# EAGLE design Electret_Microphone_Breakout (EAGLE 7.5.0)
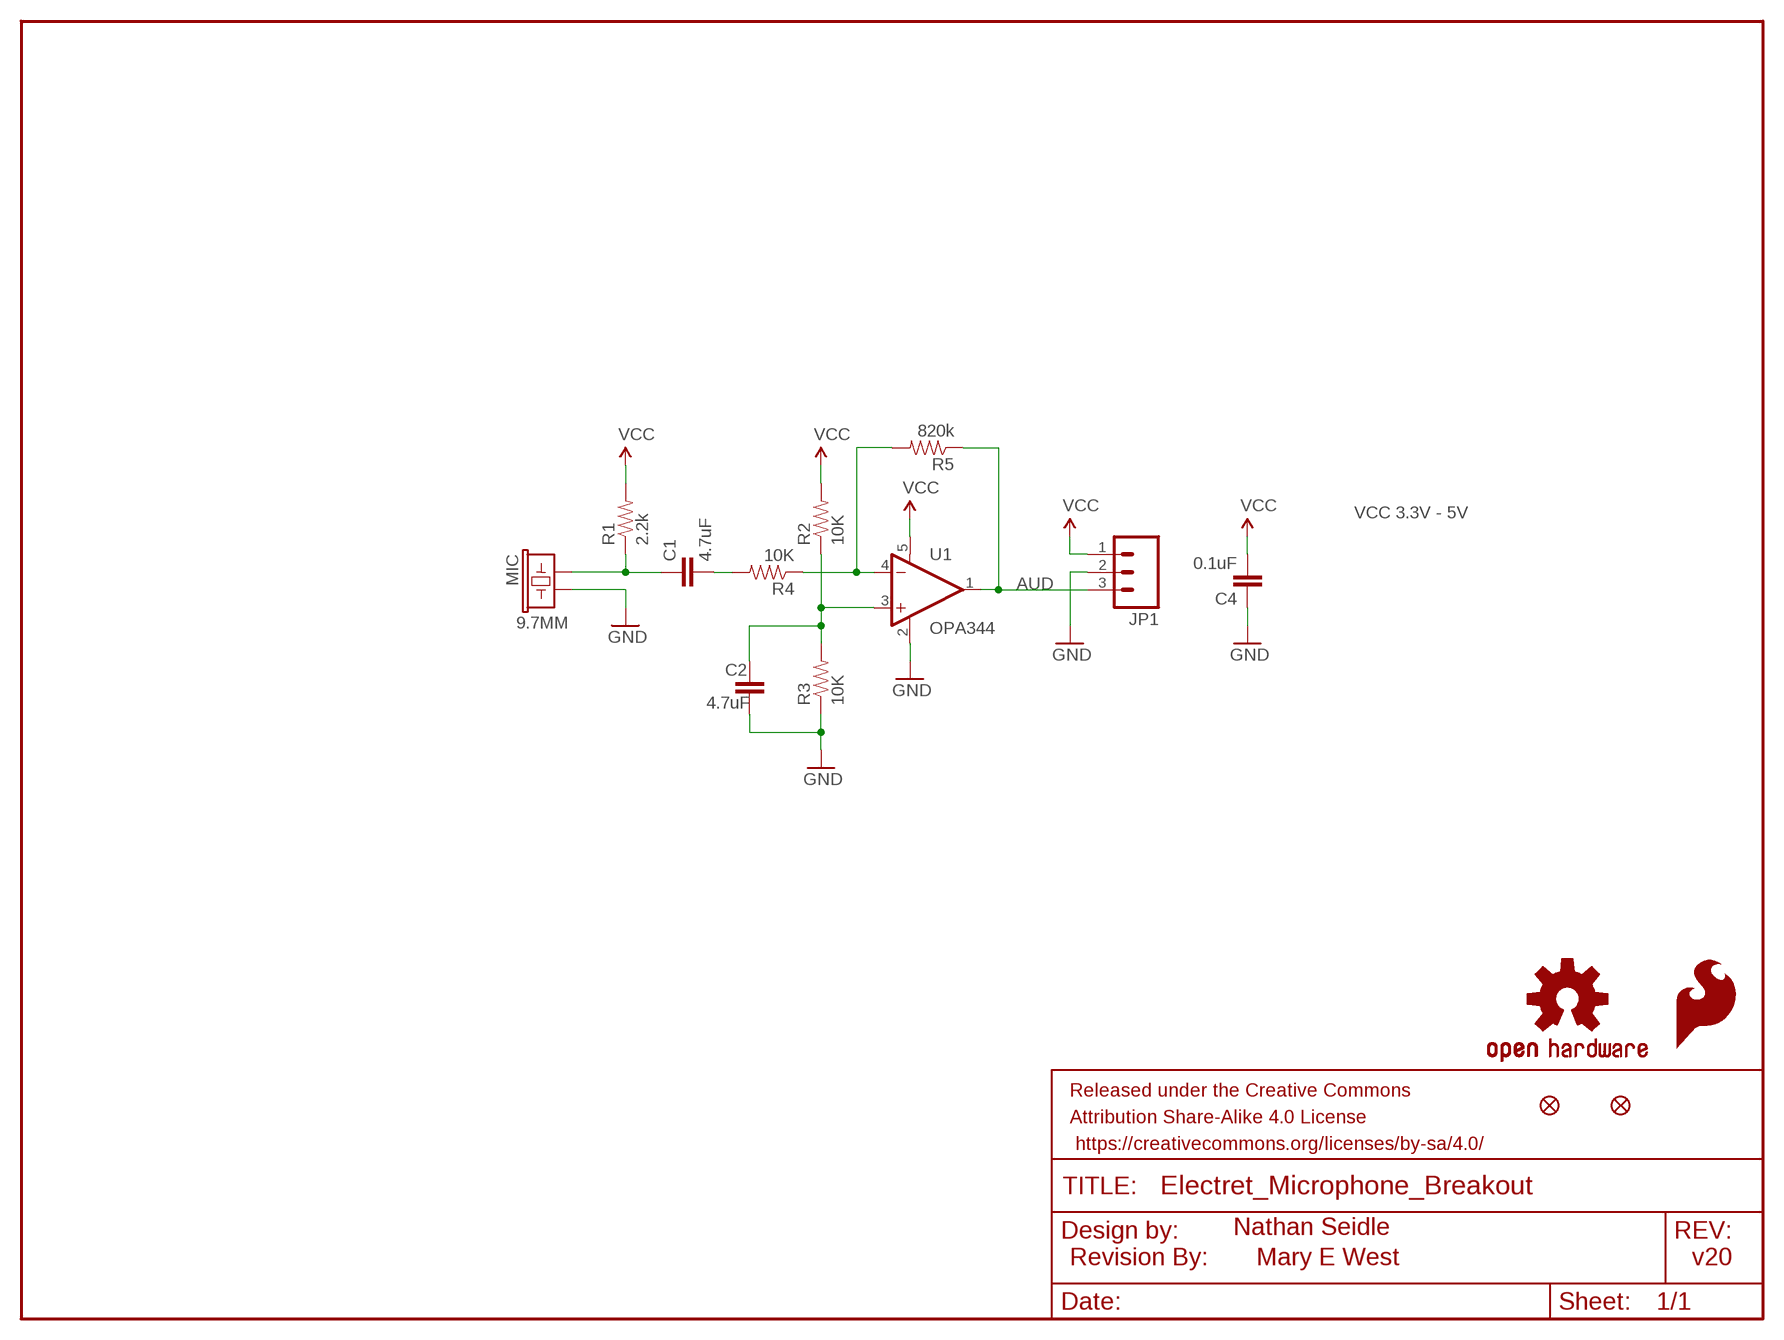
[diagram p0: schematic, sheet 1]

## Parts
C1  4.7uF  4.7UF-6.3V-10%(0603)0603  [0603-CAP]
C2  4.7uF  4.7UF-6.3V-10%(0603)0603  [0603-CAP]
C4  0.1uF  0.1UF-25V(+80/-20%)(0603)  [0603-CAP]
FRAME1  FRAME-LETTER  [CREATIVE_COMMONS]
JP1  M03PTH  [1X03]
JP2  FIDUCIALUFIDUCIAL  [MICRO-FIDUCIAL]
JP3  FIDUCIALUFIDUCIAL  [MICRO-FIDUCIAL]
LOGO1  OSHW-LOGOMINI  [OSHW-LOGO-MINI]
MIC  9.7MM  MIC9.7MM  [MIC-9.7MM]
R1  2.2k  2.2KOHM-1/10W-1%(0603)  [0603-RES]
R2  10K  10KOHM-1/10W-1%(0603)0603  [0603-RES]
R3  10K  10KOHM-1/10W-1%(0603)0603  [0603-RES]
R4  10K  10KOHM-1/10W-1%(0603)0603  [0603-RES]
R5  820k  820KOHM-1/10W-1%(0603)  [0603-RES]
U1  OPA344  [SOT23-5]
U$1  SFE_LOGO_FLAME.1_INCH  [SFE_LOGO_FLAME_.1]
U$2  REVISION  [REVISION]

## Nets
AUD: JP1.3 R5.1 U1.1(OUT)
GND: C2.2 C4.1 JP1.2 MIC.2 R3.1 U1.2(V-)
N$1: C1.1 MIC.1 R1.1
N$2: R4.1 R5.2 U1.4(-IN)
N$6: C1.2 R4.2
N$7: C2.1 R2.1 R3.2 U1.3(+IN)
VCC: C4.2 JP1.1 R1.2 R2.2 U1.5(V+)

## Notes on the sheet
- VCC 3.3V - 5V
- Nathan Seidle
- Mary E West | v20

## Library data of the parts
C1 C2 = SparkFun-Capacitors:4.7UF-6.3V-10%(0603): CAP-08280; PROD_ID: CAP-08280
C4 = SparkFun-Capacitors:0.1UF-25V(+80/-20%)(0603): CAP-00810 Ceramic Standard decoupling cap; PROD_ID: CAP-00810
FRAME1 = SparkFun-Aesthetics:FRAME-LETTER: Schematic Frame Standard 8.5x11 US Letter frame
JP1 = SparkFun:M03: Header 3 Standard 3-pin 0.1" header. Use with straight break away headers (SKU : PRT-00116), right angle break away headers (PRT-00553), swiss pins (PRT-00743), machine pins (PRT-00117), and female headers (PRT-00115). Molex polarized connector foot print use with SKU : PRT-08232 with associated crimp pins and housings.
JP2 JP3 = SparkFun-Aesthetics:FIDUCIAL: Fiducial Alignment Points Various fiducial points for machine vision alignment.
LOGO1 = SparkFun-Aesthetics:OSHW-LOGO: Open Source Hardware Logo This logo indicates the piece of hardware it is found on incorporates a OSHW license and/or adheres to the definition of open source hardware found here: http://freedomdefined.org/OSHW
MIC = SparkFun-Sensors:MIC: Omni-directional electret microphone. 9.7mm standard diameter.; PROD_ID: COMP-08856
R1 = SparkFun-Resistors:2.2KOHM-1/10W-1%(0603): RES-08272; PROD_ID: RES-08272
R2-R4 = SparkFun-Resistors:10KOHM-1/10W-1%(0603): RES-00824; PROD_ID: RES-00824
R5 = SparkFun-Resistors:820KOHM-1/10W-1%(0603); PROD_ID: RES-13247
U1 = SparkFun-AnalogIC:OPA344: Single gate rail-to-rail output op-amp. Inputs extend 300mV past rails.; PROD_ID: IC-08251
U$1 = SparkFun-Aesthetics:SFE_LOGO_FLAME: SFE Logo, flame only This is the SparkFun flame logo. The logo on the schematic will always be the same size; the package variant is the height of the flame. Default layer for the logo on the board is tSilk.
U$2 = SparkFun-Aesthetics:REVISION

## Board
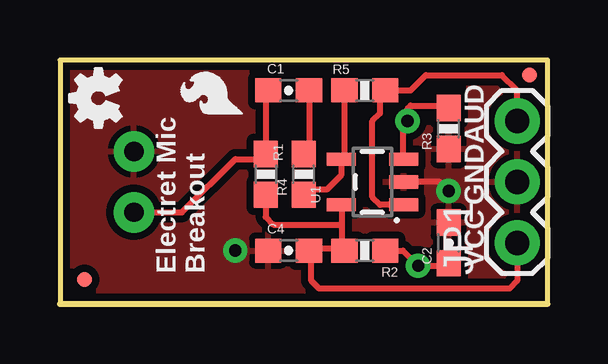
[diagram p1: board, top side]
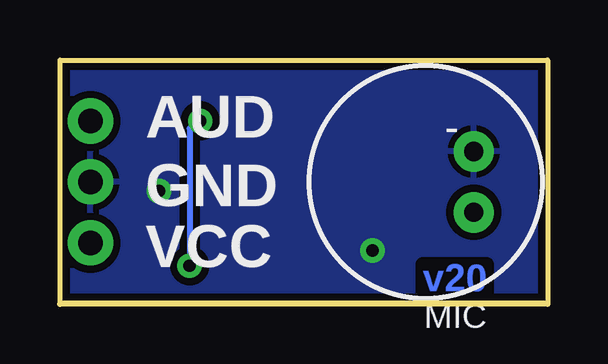
[diagram p2: board, bottom side, seen from below]

Size 20.32 x 10.16 mm. Coordinates in mm from the lower left corner, seen from the top.
Outline: 20.32,0 20.32,10.16 0,10.16 0,0 20.32,0
Copper layers (1*16): Top 0.035mm / dielectric 1.5mm / Bottom 0.035mm
Design rules "SparkFun-2-layer-TIGHT *": minimum track width 10mil, minimum drill 20mil, track to track 10mil, track to pad 8mil, pad to pad 8mil, via to via 10mil, smd to smd 8mil, copper to edge 8mil, drill to drill 8mil, minimum pad ring 10mil, minimum via ring 10mil, stop-mask expansion 4mil, vias tented up to drill 20mil, thermal gap 10mil

### Footprints (pad centres in the part's own frame; a part is rotated, then mirrored left to right if it is on the bottom)
0603-CAP = smd 1.1 x 1: 1 -0.85,0; 2 0.85,0
1X03 = drill 1.016 pad 1.88: 1 0,0; 2 2.54,0; 3 5.08,0
MICRO-FIDUCIAL = smd 0.635 x 0.635: 1 0,0
MIC-9.7MM = drill 0.8 pad 1.676: 1 -2,1.27; 2 -2,-1.27
0603-RES = smd 1.1 x 1: 1 -0.85,0; 2 0.85,0
SOT23-5 = smd 0.55 x 1.2: 1 -0.95,-1.3; 2 0,-1.3; 3 0.95,-1.3; 4 0.95,1.3; 5 -0.95,1.3

### Placement (x,y rotation side)
C1  9.53,8.89 0 top
C2  16.19,2.54 90 top
C4  9.53,2.22 0 top
FRAME1  -7.39,-9.65 0 top  (outside the outline)
JP1  19.05,2.54 90 top
JP2  19.56,9.53 0 top
JP3  1.02,1.02 0 top
LOGO1  1.59,8.57 90 top
MIC  5.08,5.08 180 bottom
R1  8.57,5.4 270 top
R2  12.7,2.22 180 top
R3  16.19,7.3 90 top
R4  10.16,5.4 90 top
R5  12.7,8.89 180 top
U1  13.02,5.08 90 top
U$1  7.94,7.62 90 top
U$2  4.06,-12.57 0 top  (outside the outline)

### Tracks (layer width: path | path; a pad name or v marks a point on that pad's centre or on a via)
AUD
  Top 0.254: JP1.3 19.05,8.89 18.41,9.53 15.24,9.53 14.61,8.89 R5.1 13.34,8.68 13.34,7.94 13.02,7.62 13.02,4.45 13.34,4.13 U1.1
GND  (via drill 0.51, 0.51 pad 0.25)
  Top 0.254: 14.29,5.08 15.81,5.08 v16.19,4.7
  other vias: 7.3,2.22
  pour Bottom (isolate 0.305): 0,0 0,10.16 20.32,10.16 20.32,0
  pour Top (isolate 0.305): 0,0 0,10.16 20.32,10.16 20.32,0
N$1
  Top 0.254: C1.1 8.57,8.89 R1.1 8.36,6.03 7.3,6.03 5.08,3.81 MIC.1
N$2
  Top 0.254: R5.2 11.85,6.16 U1.4 11.72,5.37 11.11,4.76 10.38,4.76 R4.1
N$6
  Top 0.254: C1.2 10.38,6.46 R4.2
N$7  (via drill 0.51)
  Top 0.254: 16.41,1.59 16.19,1.59 C2.1 16.09,1.59 v14.92,1.59 14.29,2.22 R2.1 | 16.23,7.87 16.23,8.11 R3.2 | 15.98,7.94 R3.2 | R3.2 16.09,8.26 14.61,8.26 14.48,8.13 v14.48,7.62 14.48,7.49 14.29,7.3 14.29,6.06 U1.3
  Bottom 0.254: 14.29,7.62 v14.48,7.62 14.61,7.62 14.92,7.3 v14.92,1.59
VCC
  Top 0.254: U1.5 11.74,4.13 11.75,4.13 11.75,3.3 | 11.75,3.3 8.89,3.3 8.57,3.62 R1.2 | JP1.1 19.05,0.95 18.73,0.64 10.79,0.64 10.48,0.95 10.48,2.22 C4.2 | 11.75,3.3 11.75,2.64 arc180 R2.2 11.75,2.33 10.48,2.33 C4.2 | C4.2

### Text on the board
Bottom: v20
tPlace: AUD | GND | VCC | Electret Mic / Breakout
bPlace: AUD | GND | VCC
tValues: DNP | Mic on opposite side
Measures: All units inches
tDocu: Nathan Seidle | Mary E West